# Altium schematic sheet ECG&PressureSensor.SchDoc
size A4; Revision: B.2
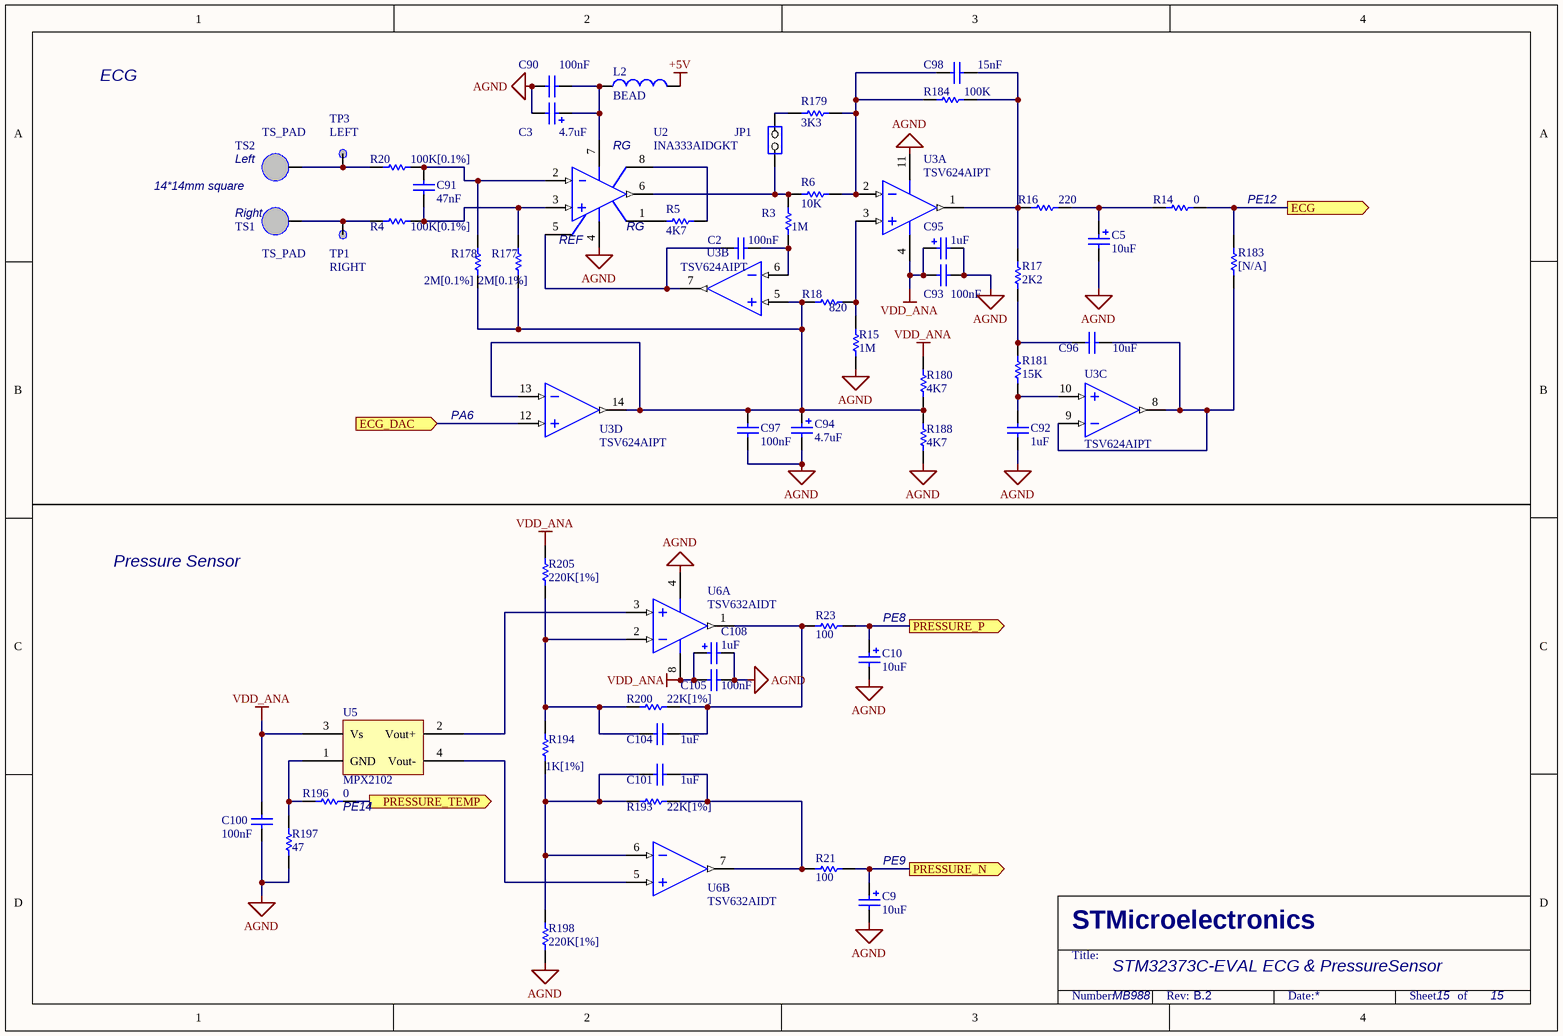
[diagram p0: ECG&PressureSensor.SchDoc]

## Parts
C2  100nF  [0603C]
C3  4.7uF  [TAN-A]
C5  10uF  [TAN-A]
C9  10uF  [TAN-A]
C10  10uF  [TAN-A]
C90  100nF  [0603C]
C91  47nF  [0603C]
C92  1uF  [0603C]
C93  100nF  [0603C]
C94  4.7uF  [TAN-A]
C95  1uF  [TAN-A]
C96  10uF  [0805C]
C97  100nF  [0603C]
C98  15nF  [0603C]
C100  100nF  [0603C]
C101  1uF  [0603C]
C104  1uF  [0603C]
C105  100nF  [0603C]
C108  1uF  [TAN-A]
JP1  (no value)  [SIP2]
L2  BEAD  [0603L]
R3  1M  [0603R]
R4  100K[0.1%]  [0603R]
R5  4K7  [0603R]
R6  10K  [0603R]
R14  0  [0603R]
R15  1M  [0603R]
R16  220  [0603R]
R17  2K2  [0603R]
R18  820  [0603R]
R20  100K[0.1%]  [0603R]
R21  100  [0603R]
R23  100  [0603R]
R177  2M[0.1%]  [0603R]
R178  2M[0.1%]  [0603R]
R179  3K3  [0603R]
R180  4K7  [0603R]
R181  15K  [0603R]
R183  [N/A]  [0603R]
R184  100K  [0603R]
R188  4K7  [0603R]
R193  22K[1%]  [0603R]
R194  1K[1%]  [0603R]
R196  0  [0603R]
R197  47  [0603R]
R198  220K[1%]  [0603R]
R200  22K[1%]  [0603R]
R205  220K[1%]  [0603R]
TP1  RIGHT  [TP]
TP3  LEFT  [TP]
TS1  TS_PAD  [TS_PAD]
TS2  TS_PAD  [TS_PAD]
U2  INA333AIDGKT  [MSOP8]
U3  TSV624AIPT  [TSSOP14]  (parts A,B,C,D of 4)
U5  MPX2102  [MPAK]
U6  TSV632AIDT  [SO8]  (parts A,B of 2)

## Ports
ECG (out), ECG_DAC (in), PRESSURE_N (out), PRESSURE_P (out), PRESSURE_TEMP (out)

## Nets
+5V: L2.2
AGND: C3.2 C5.2 C9.2 C10.2 C90.1 C92.1 C93.1 C94.2 C95.2 C97.1 C100.1 C105.1 C108.2 R15.1 R188.1 R197.1 R198.2 U2.4(V-) U3.11(V+) U6.4(V-)
VDD_ANA: C93.2 C95.1 C100.2 C105.2 C108.1 R180.2 R205.1 U3.4(V-) U5.3(Vs) U6.8(V+)
ECG: R14.1 R183.1 ; port ECG
ECG_DAC: U3.12(IN+) ; port ECG_DAC
PRESSURE_N: C9.1 R21.1 ; port PRESSURE_N
PRESSURE_P: C10.1 R23.1 ; port PRESSURE_P
PRESSURE_TEMP: R196.1 ; port PRESSURE_TEMP
NetC2_1: C2.1 U2.5(REF) U3.7(OUT)
NetC2_2: C2.2 R3.1 U3.6(IN-)
NetC3_1: C3.1 C90.2 L2.1 U2.7(V+)
NetC5_1: C5.1 R14.2 R16.2
NetC91_1: C91.1 R4.2 R177.2 U2.3(IN+)
NetC91_2: C91.2 R20.2 R178.2 U2.2(IN-)
NetC92_2: C92.2 R181.1 U3.10(IN+)
NetC94_1: C94.1 C97.2 R18.1 R177.1 R178.1 R180.1 R188.2 U3.5(IN+) U3.13(IN-) U3.14(OUT)
NetC96_1: C96.1 R17.2 R181.2
NetC96_2: C96.2 R183.2 U3.8(OUT) U3.9(IN-)
NetC98_1: C98.1 R16.1 R17.1 R184.2 U3.1(OUT)
NetC98_2: C98.2 R6.2 R179.1 R184.1 U3.2(IN-)
NetC101_1: C101.1 R193.1 R194.1 R198.1 U6.6(IN-)
NetC101_2: C101.2 R21.2 R193.2 U6.7(OUT)
NetC104_1: C104.1 R194.2 R200.1 R205.2 U6.2(IN-)
NetC104_2: C104.2 R23.2 R200.2 U6.1(OUT)
NetJP1_1: JP1.1(COMMON) R179.2
NetJP1_2: JP1.2(NO) R3.2 R6.1 U2.6(OUT)
NetR4_1: R4.1 TP1.1 TS1.1
NetR5_1: R5.1 U2.8(RG)
NetR5_2: R5.2 U2.1(RG)
NetR15_2: R15.2 R18.2 U3.3(IN+)
NetR20_1: R20.1 TP3.1 TS2.1
NetR196_2: R196.2 R197.2 U5.1(GND)
NetU5_2: U5.2(Vout+) U6.3(IN+)
NetU5_4: U5.4(Vout-) U6.5(IN+)

## Notes on the sheet
- ECG
- (near TS2) Left
- (near U2) RG
- 14*14mm square
- (near TS1) Right
- (near U2) REF
- PE12
- PA6
- Pressure Sensor
- PE8
- (near R196) PE14
- PE9
- STM32373C-EVAL ECG & PressureSensor
- MB988
- 15
- STMicroelectronics
- Title:
- Number:
- Rev:
- Date:
- Sheet       of

## Library data of the parts
C2 C90 C91 C93 C97 C98 C100 C105 = CAP: Capacitor; Value: 100pF; Published: 8-Jun-2000; Revision: July-2002: Re-released for DXP Platform.; Publisher: Altium Limited
C3 C94 = Cap Pol1: Polarized Capacitor (Radial); Value: 100pF; Published: 8-Jun-2000; Revision: July-2002: Re-released for DXP Platform.; Publisher: Altium Limited
C5 C9 C10 = Cap Pol1: Polarized Capacitor (Radial); Published: 8-Jun-2000; Revision: July-2002: Re-released for DXP Platform.; Publisher: Altium Limited; Value: 10uF
C92 C96 C101 C104 = CAP: Capacitor; Value: 100nF; Published: 8-Jun-2000; Revision: July-2002: Re-released for DXP Platform.; Publisher: Altium Limited
C95 C108 = Cap Pol1: Polarized Capacitor (Radial); Value: 10uF; Published: 8-Jun-2000; Revision: July-2002: Re-released for DXP Platform.; Publisher: Altium Limited
JP1 = JP2
L2 = Inductor: Value: 100uH; Published: 8-Jun-2000; Revision: July-2002: Re-released for DXP Platform.; Publisher: Altium Limited
R3-R5 R14-R18 R20 R21 R23 R177-R181 R183 R184 R188 R193 R194 R196-R198 R200 R205 = Res1: Resistor; Value: 1K; Published: 8-Jun-2000; Revision: July-2002: Re-released for DXP Platform.; Publisher: Altium Limited
R6 = res1: Resistor; Value: 1K; Published: 8-Jun-2000; Revision: July-2002: Re-released for DXP Platform.; Publisher: Altium Limited
TP1 TP3 = TP
U2 = INA333
U3 = TSV624A